# EAGLE design EVmulator_T10_Compact (EAGLE 9.6.2)
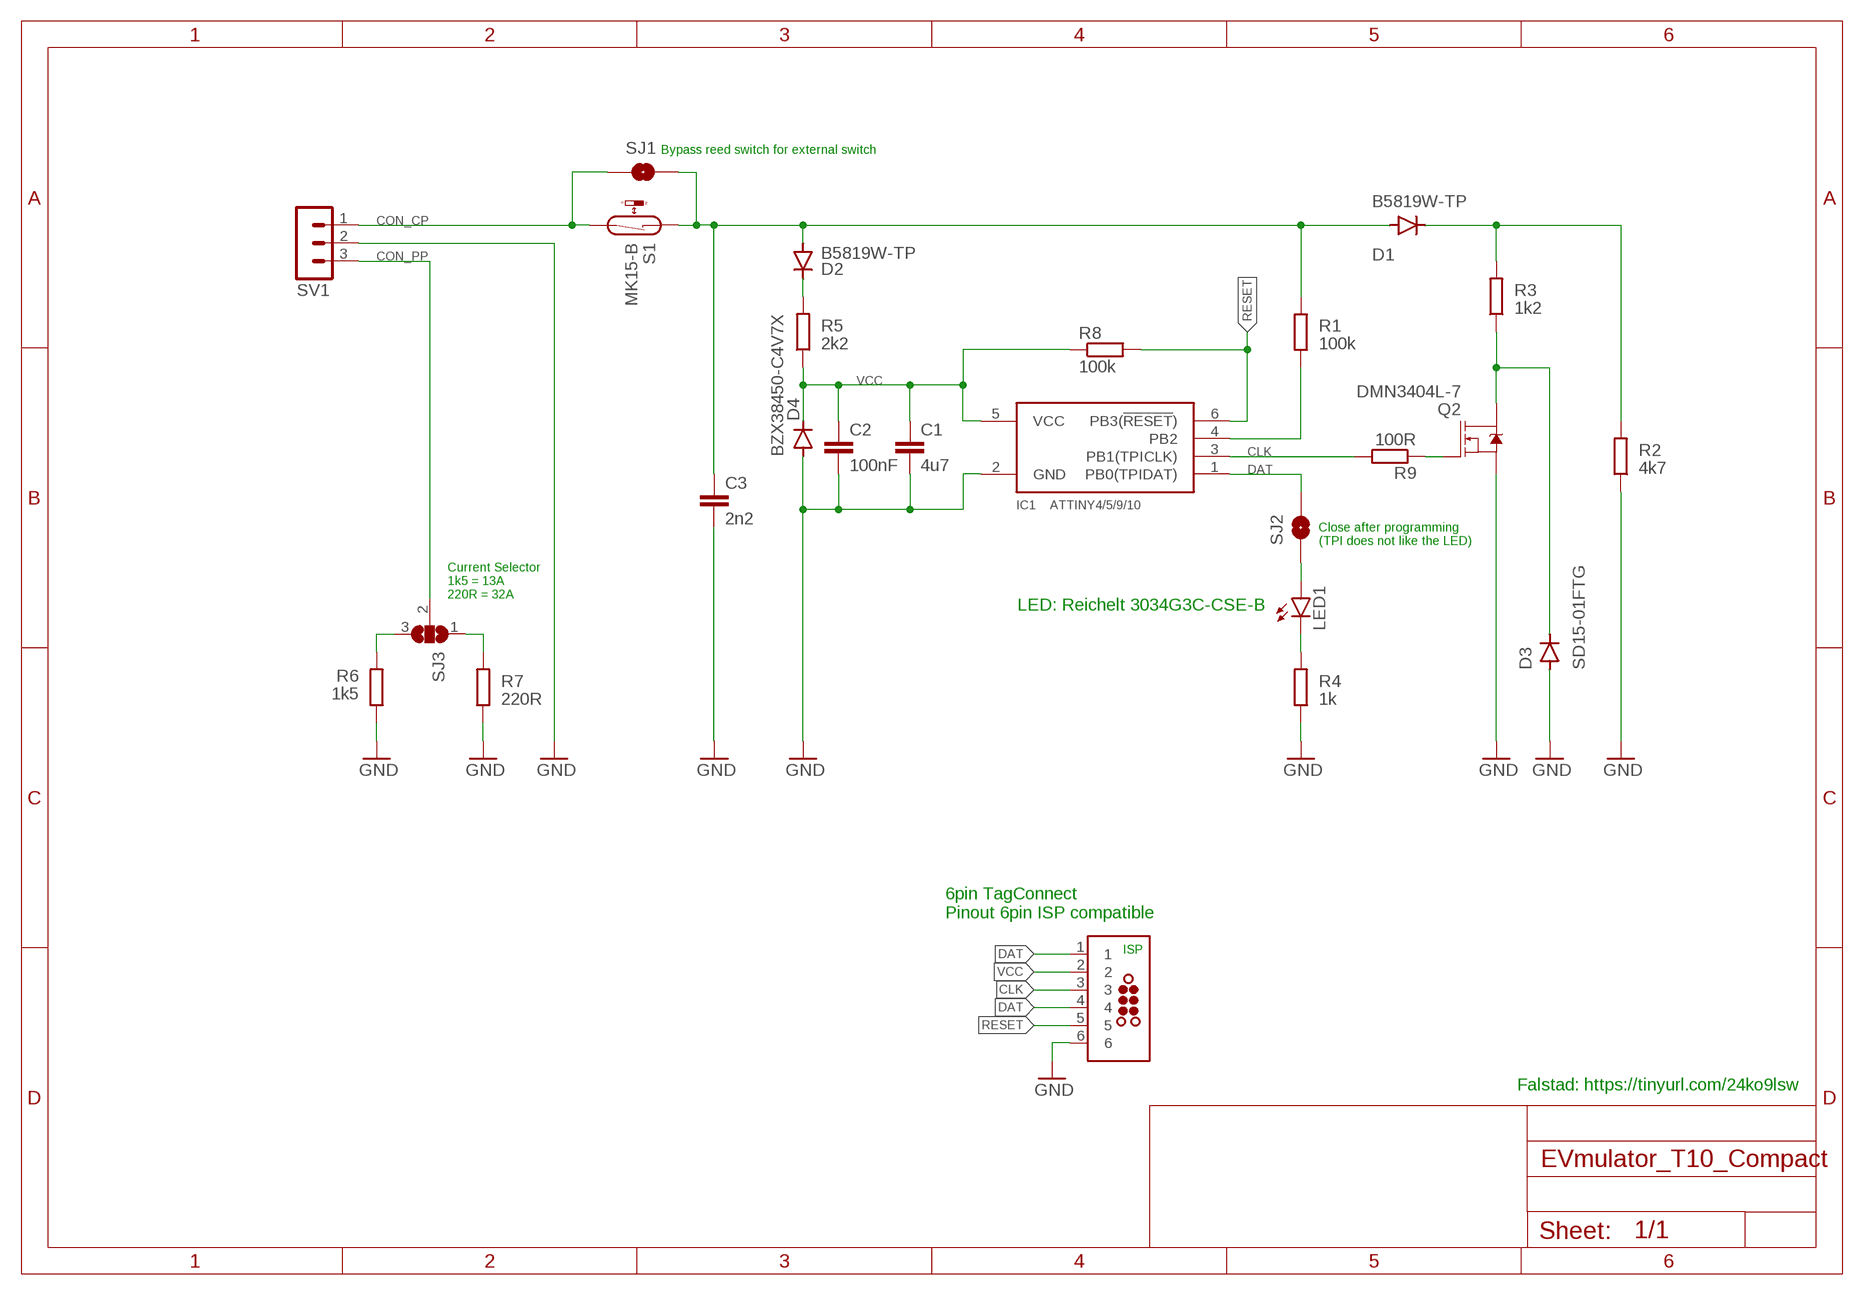
[diagram p0: schematic, sheet 1]

## Parts
C1  4u7  C-EUC0603  [C0603]
C2  100nF  C-EUC0603  [C0603]
C3  2n2  C-EUC0603  [C0603]
D1  B5819W-TP  DIODE-SOD123  [SOD123]
D2  B5819W-TP  DIODE-SOD123  [SOD123]
D3  SD15-01FTG  DIODE-SOD323-W  [SOD323-W]
D4  BZX38450-C4V7X  DIODE-SOD323-W  [SOD323-W]
IC1  ATTINY4/5/9/10  [SOT23-6]
J1  TAG-CONNECT_TC2030-MCP-NL  [TAG-CONNECT_TC2030-MCP-NL]
LED1  LED3MM  [LED3MM]
Q2  DMN3404L-7  MOSFET-NCH-AO3404A  [SOT23-3]
R1  100k  R-EU_R0603  [R0603]
R2  4k7  R-EU_R0603  [R0603]
R3  1k2  R-EU_R0603  [R0603]
R4  1k  R-EU_R0603  [R0603]
R5  2k2  R-EU_R0603  [R0603]
R6  1k5  R-EU_R0805  [R0805]
R7  220R  R-EU_R0805  [R0805]
R8  100k  R-EU_R0603  [R0603]
R9  100R  R-EU_R0603  [R0603]
S1  MK15-B  REED-SWITCH-MK15-B  [MK15]
SJ1  JUMPER-SMT_2_NO_SILK  [SMT-JUMPER_2_NO_SILK]
SJ2  JUMPER-SMT_2_NO_SILK  [SMT-JUMPER_2_NO_SILK]
SJ3  SJ2W  [SJ_2]
SV1  MA03-1  [MA03-1]

## Nets
CLK: IC1.3(PB1(TPICLK)) J1.3 R9.2
CON_CP: S1.2 SJ1.1 SV1.1
CON_PP: SJ3.2 SV1.3
CP: C3.1 D1.A D2.A R1.1 S1.1 SJ1.2
DAT: IC1.1(PB0(TPIDAT)) J1.1 J1.4 SJ2.2
GND: C1.2 C2.2 C3.2 D3.A D4.A IC1.2(GND) J1.6 Q2.2(S) R2.1 R4.1 R6.1 R7.1 SV1.2
N$1: Q2.1(G) R9.1
N$3: IC1.4(PB2) R1.2
N$4: D3.C Q2.3(D) R3.1
N$6: LED1.K(C) R4.2
N$7: D1.C R2.2 R3.2
N$8: D2.C R5.2
N$10: LED1.A SJ2.1
N$11: R6.2 SJ3.3
N$12: R7.2 SJ3.1
RESET: IC1.6(PB3(!RESET!)) J1.5 R8.2
VCC: C1.1 C2.1 D4.C IC1.5(VCC) J1.2 R5.1 R8.1

## Notes on the sheet
- Bypass reed switch for external switch
- Close after programming
  (TPI does not like the LED)
- Current Selector
  1k5 = 13A
  220R = 32A
- LED: Reichelt 3034G3C-CSE-B
- 6pin TagConnect
  Pinout 6pin ISP compatible
- ISP
- Falstad: https://tinyurl.com/24ko9lsw

## Library data of the parts
C1-C3 = rcl:C-EU: CAPACITOR, European symbol; SPICEPREFIX: C
D1-D4 = diode:DIODE-: DIODE
IC1 = Eigene-Rietig:ATTINY4/5/9/10
J1 = Eigene-Rietig:TAG-CONNECT_TC2030: TAG-CONNECT ICSP Connector Manufacturer: Tag-Connect <http://www.tag-connect.com> Cable for easy In-Circuit Serial Programming. Designed for Microchip ICD2, suitable for many others. Two variants - one "with legs" (for hands-free fit on PCB) and another "without legs" for quick programming. PAD Description 1 MCLR/Vpp 2 Vdd 3 GND 4 PGD (ISPDAT) 5 PGC (ISPCLK) 6 nc (used for LVP) ©2009 ROFA.cz - modified and updated by Robert Darlington ‹rdarlington@gmail.com›
LED1 = led:LED: LED OSRAM: - CHIPLED LG R971, LG N971, LY N971, LG Q971, LY Q971, LO R971, LY R971 LH N974, LH R974 LS Q976, LO Q976, LY Q976 LO Q996 - Hyper CHIPLED LW Q18S LB Q993, LB Q99A, LB R99A - SideLED LS A670, LO A670, LY A670, LG A670, LP A670 LB A673, LV A673, LT A673, LW A673 LH A674 LY A675 LS A676, LA A676, LO A676, LY A676, LW A676 LS A679, LY A679, LG A679 - Hyper Micro SIDELED® LS Y876, LA Y876, LO Y876, LY Y876 LT Y87S - SmartLED LW L88C, LW L88S LB L89C, LB L89S, LG L890 LS L89K, LO L89K, LY L89K LS L896, LA L896, LO L896, LY L896 - TOPLED LS T670, LO T670, LY T670, LG T670, LP T670 LSG T670, LSP T670, LSY T670, LOP T670, LYG T670 LG T671, LOG T671, LSG T671 LB T673, LV T673, LT T673, LW T673 LH T674 LS T676, LA T676, LO T676, LY T676, LB T676, LH T676, LSB T676, LW T676 LB T67C, LV T67C, LT T67C, LS T67K, LO T67K, LY T67K, LW E67C LS E67B, LA E67B, LO E67B, LY E67B, LB E67C, LV E67C, LT E67C LW T67C LS T679, LY T679, LG T679 LS T770, LO T770, LY T770, LG T770, LP T770 LB T773, LV T773, LT T773, LW T773 LH T774 LS E675, LA E675, LY E675, LS T675 LS T776, LA T776, LO T776, LY T776, LB T776 LHGB T686 LT T68C, LB T68C - Hyper Mini TOPLED® LB M676 - Mini TOPLED Santana® LG M470 LS M47K, LO M47K, LY M47K Source: http://www.osram.convergy.de LUXEON: - LUMILED® LXK2-PW12-R00, LXK2-PW12-S00, LXK2-PW14-U00, LXK2-PW14-V00 LXK2-PM12-R00, LXK2-PM12-S00, LXK2-PM14-U00 LXK2-PE12-Q00, LXK2-PE12-R00, LXK2-PE12-S00, LXK2-PE14-T00, LXK2-PE14-U00 LXK2-PB12-K00, LXK2-PB12-L00, LXK2-PB12-M00, LXK2-PB14-N00, LXK2-PB14-P00, LXK2-PB14-Q00 LXK2-PR12-L00, LXK2-PR12-M00, LXK2-PR14-Q00, LXK2-PR14-R00 LXK2-PD12-Q00, LXK2-PD12-R00, LXK2-PD12-S00 LXK2-PH12-R00, LXK2-PH12-S00 LXK2-PL12-P00, LXK2-PL12-Q00, LXK2-PL12-R00 Source: www.luxeon.com KINGBRIGHT: KA-3528ASYC Source: www.kingbright.com
Q2 = SparkFun-DiscreteSemi:MOSFET-NCH: N-channel MOSFETs Voltage controlled devices that allow control of high current outputs. SparkFun Products: SparkFun OpenScale <https://www.sparkfun.com/products/13261> SparkFun Digital Sandbox <https://www.sparkfun.com/products/12651> SparkFun Monster Moto Shield <https://www.sparkfun.com/products/10182> SparkFun MOSFET Power Controller <https://www.sparkfun.com/products/11214>; PROD_ID: TRANS-12988; VALUE: 5.8A/30V/35mΩ
R1-R9 = rcl:R-EU_: RESISTOR, European symbol; SPICEPREFIX: R
S1 = switch-reed:REED-SWITCH-: Reed Sensor; MF: MEDER; MPN: MK15-B-2; OC_FARNELL: 1079484
SJ1 SJ2 = SparkFun-Jumpers:JUMPER-SMT_2_NO: Normally open jumper This jumper has two pads in close proximity to each other. Apply solder to close the connection. Round pads are easier to solder for beginners, but are a lot larger. SparkFun Product that uses the round pads: SparkFun EL Sequencer <https://www.sparkfun.com/products/12781>
SJ3 = jumper:SJ2W: SMD solder JUMPER
SV1 = con-lstb:MA03-1: PIN HEADER; OC_FARNELL: unknown; OC_NEWARK: unknown

## Board
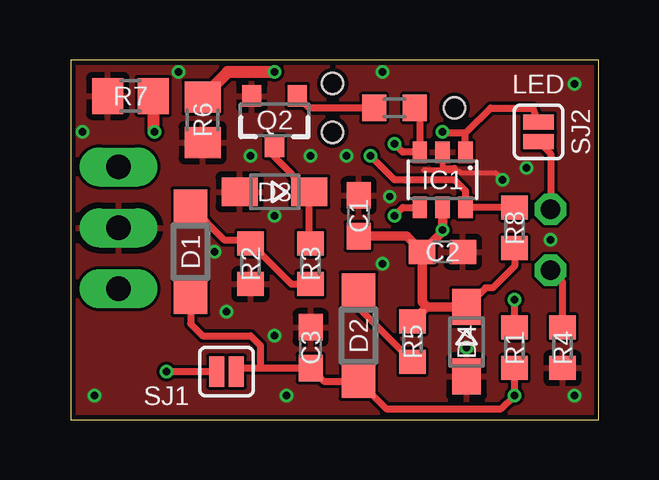
[diagram p1: board, top side]
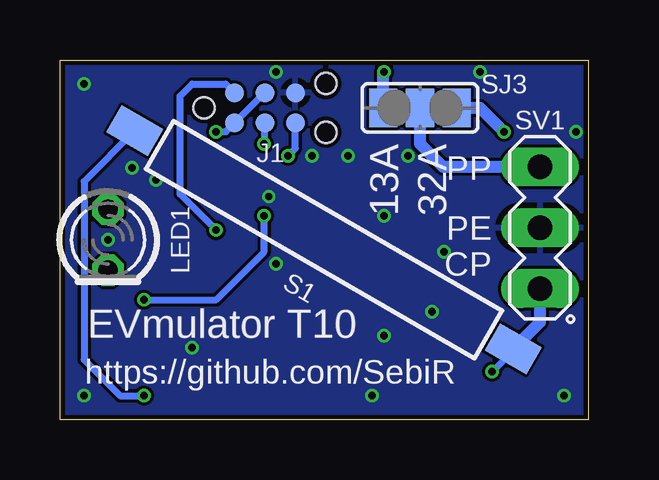
[diagram p2: board, bottom side, seen from below]

Size 22 x 15 mm. Coordinates in mm from the lower left corner, seen from the top.
Outline: 0,0 22,0 22,15 0,15 0,0
Copper layers (1*16): Top 0.035mm / dielectric 1.6mm / Bottom 0.035mm
Design rules "jlcpcb-2layers": minimum track width 0.2mm, minimum drill 0.3mm, track to track 5mil, track to pad 5mil, pad to pad 5mil, via to via 5mil, smd to smd 5mil, copper to edge 0.2mm, drill to drill 6mil, minimum pad ring 0.125mm, minimum via ring 0.125mm, stop-mask expansion 4mil, vias tented up to drill 0.5mm, thermal gap 10mil

### Footprints (pad centres in the part's own frame; a part is rotated, then mirrored left to right if it is on the bottom)
C0603 = smd 1.1 x 1: 1 -0.85,0; 2 0.85,0
SOD123 = smd 1.4 x 1.4: A 1.9,0; C -1.9,0
SOD323-W = smd 1.5 x 1.2: A 1.45,0; C -1.45,0
SOT23-6 = smd 0.6 x 0.9: 1 -0.95,-1.15; 2 0,-1.15; 3 0.95,-1.15; 4 0.95,1.15; 5 0,1.15; 6 -0.95,1.15
TAG-CONNECT_TC2030-MCP-NL = smd 0.787 x 0.787: 1 1.27,-0.635; 2 1.27,0.635; 3 2.54,-0.635; 4 2.54,0.635; 5 3.81,-0.635; 6 3.81,0.635 | hole 0.889: 0,0; 5.08,-1.016; 5.08,1.016
LED3MM = drill 0.813 octagon: A -1.27,0; K 1.27,0
SOT23-3 = smd 0.8 x 0.9: 1 -0.95,-1; 2 0.95,-1; 3 0,1.1
R0603 = smd 1 x 1.1: 1 -0.85,0; 2 0.85,0
R0805 = smd 1.3 x 1.5: 1 -0.95,0; 2 0.95,0
MK15 = smd 2 x 1.3: 1 -9.1,0; 2 9.1,0
SMT-JUMPER_2_NO_SILK = smd 0.635 x 1.27: 1 -0.406,0; 2 0.406,0
SJ_2 = smd 1.168 x 1.6: 1 -1.524,0; 2 0,0; 3 1.524,0
MA03-1 = drill 1.016 long: 1 -2.54,0; 2 0,0; 3 2.54,0

### Placement (x,y rotation side)
C1  12,8.5 90 top
C2  15.5,7 0 top
C3  10,3 90 top
D1  5,7 270 top
D2  12,3.5 270 top
D3  8.5,9.5 180 top
D4  16.5,3.25 270 top
IC1  15.5,10 180 top
J1  16,13 0 bottom
LED1  20,7.5 270 bottom
Q2  8.5,12.5 180 top
R1  18.5,3 90 top
R2  7.5,6.5 90 top
R3  10,6.5 270 top
R4  20.5,3 90 top
R5  14.25,3.25 270 top
R6  5.5,12.5 90 top
R7  2.5,13.5 0 top
R8  18.5,8 90 top
R9  13.5,13 0 top
S1  11,7.5 330 bottom
SJ1  6.5,2 0 top
SJ2  19.5,12 90 top
SJ3  7,13 180 bottom
SV1  2,8 90 bottom

### Tracks (layer width: path | path; a pad name or v marks a point on that pad's centre or on a via)
CLK  (via drill 0.3)
  Top 0.3: v13.5,11.5 13.85,11.15 IC1.3 14.55,12.8 R9.2
  Bottom 0.3: v13.5,11.5 13.46,11.54 J1.3
CON_CP  (via drill 0.3)
  Top 0.3: SJ1.1 v4,2
  Bottom 0.3: v4,2 3.12,2.88 S1.2
  Bottom 0.5: S1.2 2,4.07 SV1.1
CON_PP
  Bottom 0.5: SV1.3 6.04,10.54 7,11.5 SJ3.2
CP  (via drill 0.3)
  Top 0.3: SJ1.2 6.95,2.04 6.91,2.15 7.91,2.15 | 7.91,2.15 C3.1 10.55,1.6 D2.A 13.15,0.45 17.95,0.45 v18.5,1 R1.1 | D1.A 5,4 5.5,3.5 7.5,3.5 7.91,3.09 7.91,2.15
  Bottom 0.3: S1.1 21,9.93 21,2.5 19.5,1 v18.5,1
DAT  (via drill 0.3)
  Top 0.3: IC1.1 16.45,11.95 | 16.45,11.95 17.5,13 19.26,13 SJ2.2 | 16.45,11.95 15.55,11.95 v15.5,12
  Bottom 0.3: J1.4 J1.1 15.09,12 v15.5,12
GND  (via drill 0.3)
  Top 0.2: 15.5,10.5 15.62,10.38 16.16,10.38 16.23,10.3 17.7,10.3 v18,10 | 15.5,10.5 15.4,10.4 14.7,10.4 | IC1.2 15.5,10.6 | 15.5,10.6 15.5,10.5 | 16,10.5 15.6,10.5 15.5,10.6
  Top 0.25: 15.99,10.5 16,10.5
  other vias: 21,14 21,1 16.5,3 1,1 0.5,12 13,6.5 10,11 6.5,4.5 13,14.5 8.5,3.5 9,1 20,7.5 7.5,11 19,10.5 11.5,11 8.5,8.5 6,7 4.5,14.5 13.3,9.3
  pour Top: 0,15 22,15 22,0 0,0
  pour Bottom: 0,15 22,15 22,0 0,0
N$1
  Top 0.3: R9.1 9.95,13 Q2.1
N$3  (via drill 0.3)
  Top 0.3: R1.2 v18.5,5 | v13.5,8.5 13.85,8.85 IC1.4
  Bottom 0.3: v18.5,5 15.5,5 13.5,7 v13.5,8.5
N$4
  Top 0.3: Q2.3 8.5,10.95 D3.C 9.95,7.4 R3.1
N$6
  Top 0.3: R4.2 20.5,5.73 LED1.K
N$7
  Top 0.3: D1.C 6.4,7.5 7.35,7.5 R2.2 9.2,5.65 R3.2
N$8
  Top 0.3: D2.C 12,4.65 R5.2
N$10
  Top 0.3: SJ2.1 20,11.09 LED1.A
N$11  (via drill 0.3)
  Top 0.5: v8.5,14.5 6.55,14.5 R6.2
  Bottom 0.3: 8.52,14.48 v8.5,14.5
  Bottom 0.5: SJ3.3 8.52,14.48
N$12  (via drill 0.3)
  Top 0.5: R7.2 3.45,12.05 v3.5,12
  Bottom 0.5: v3.5,12 4.5,13 SJ3.1
RESET  (via drill 0.3)
  Top 0.3: 16.45,9 16.45,9.55 16,10 13.5,10 v12.5,11 | 16.45,9 IC1.6 | R8.2 16.6,8.85 16.45,9
  Bottom 0.3: v12.5,11 12.19,11.31 J1.5
VCC  (via drill 0.3)
  Top 0.3: R8.1 18.5,6.4 17.6,5.5 17.3,5.5 D4.C
  Top 0.4: D4.C 14.85,4.7 | 14.85,4.7 R5.1 | C2.1 14.65,4.9 14.85,4.7 | IC1.5 v15.5,7.9 15.5,7.85 C2.1 | C1.1 14,7.65 C2.1
  Bottom 0.3: J1.2 15.1,14 16.5,14 17,13.5 17,9.4 v15.5,7.9

### Text on the board
tPlace: LED
bPlace: PP | 32A | 13A | PE | CP | EVmulator T10 | https://github.com/SebiR
Document: TPICLK | GND | TPIDAT | 3V3 | RESET | S G M R V